# EAGLE design card (EAGLE 7.4.0)
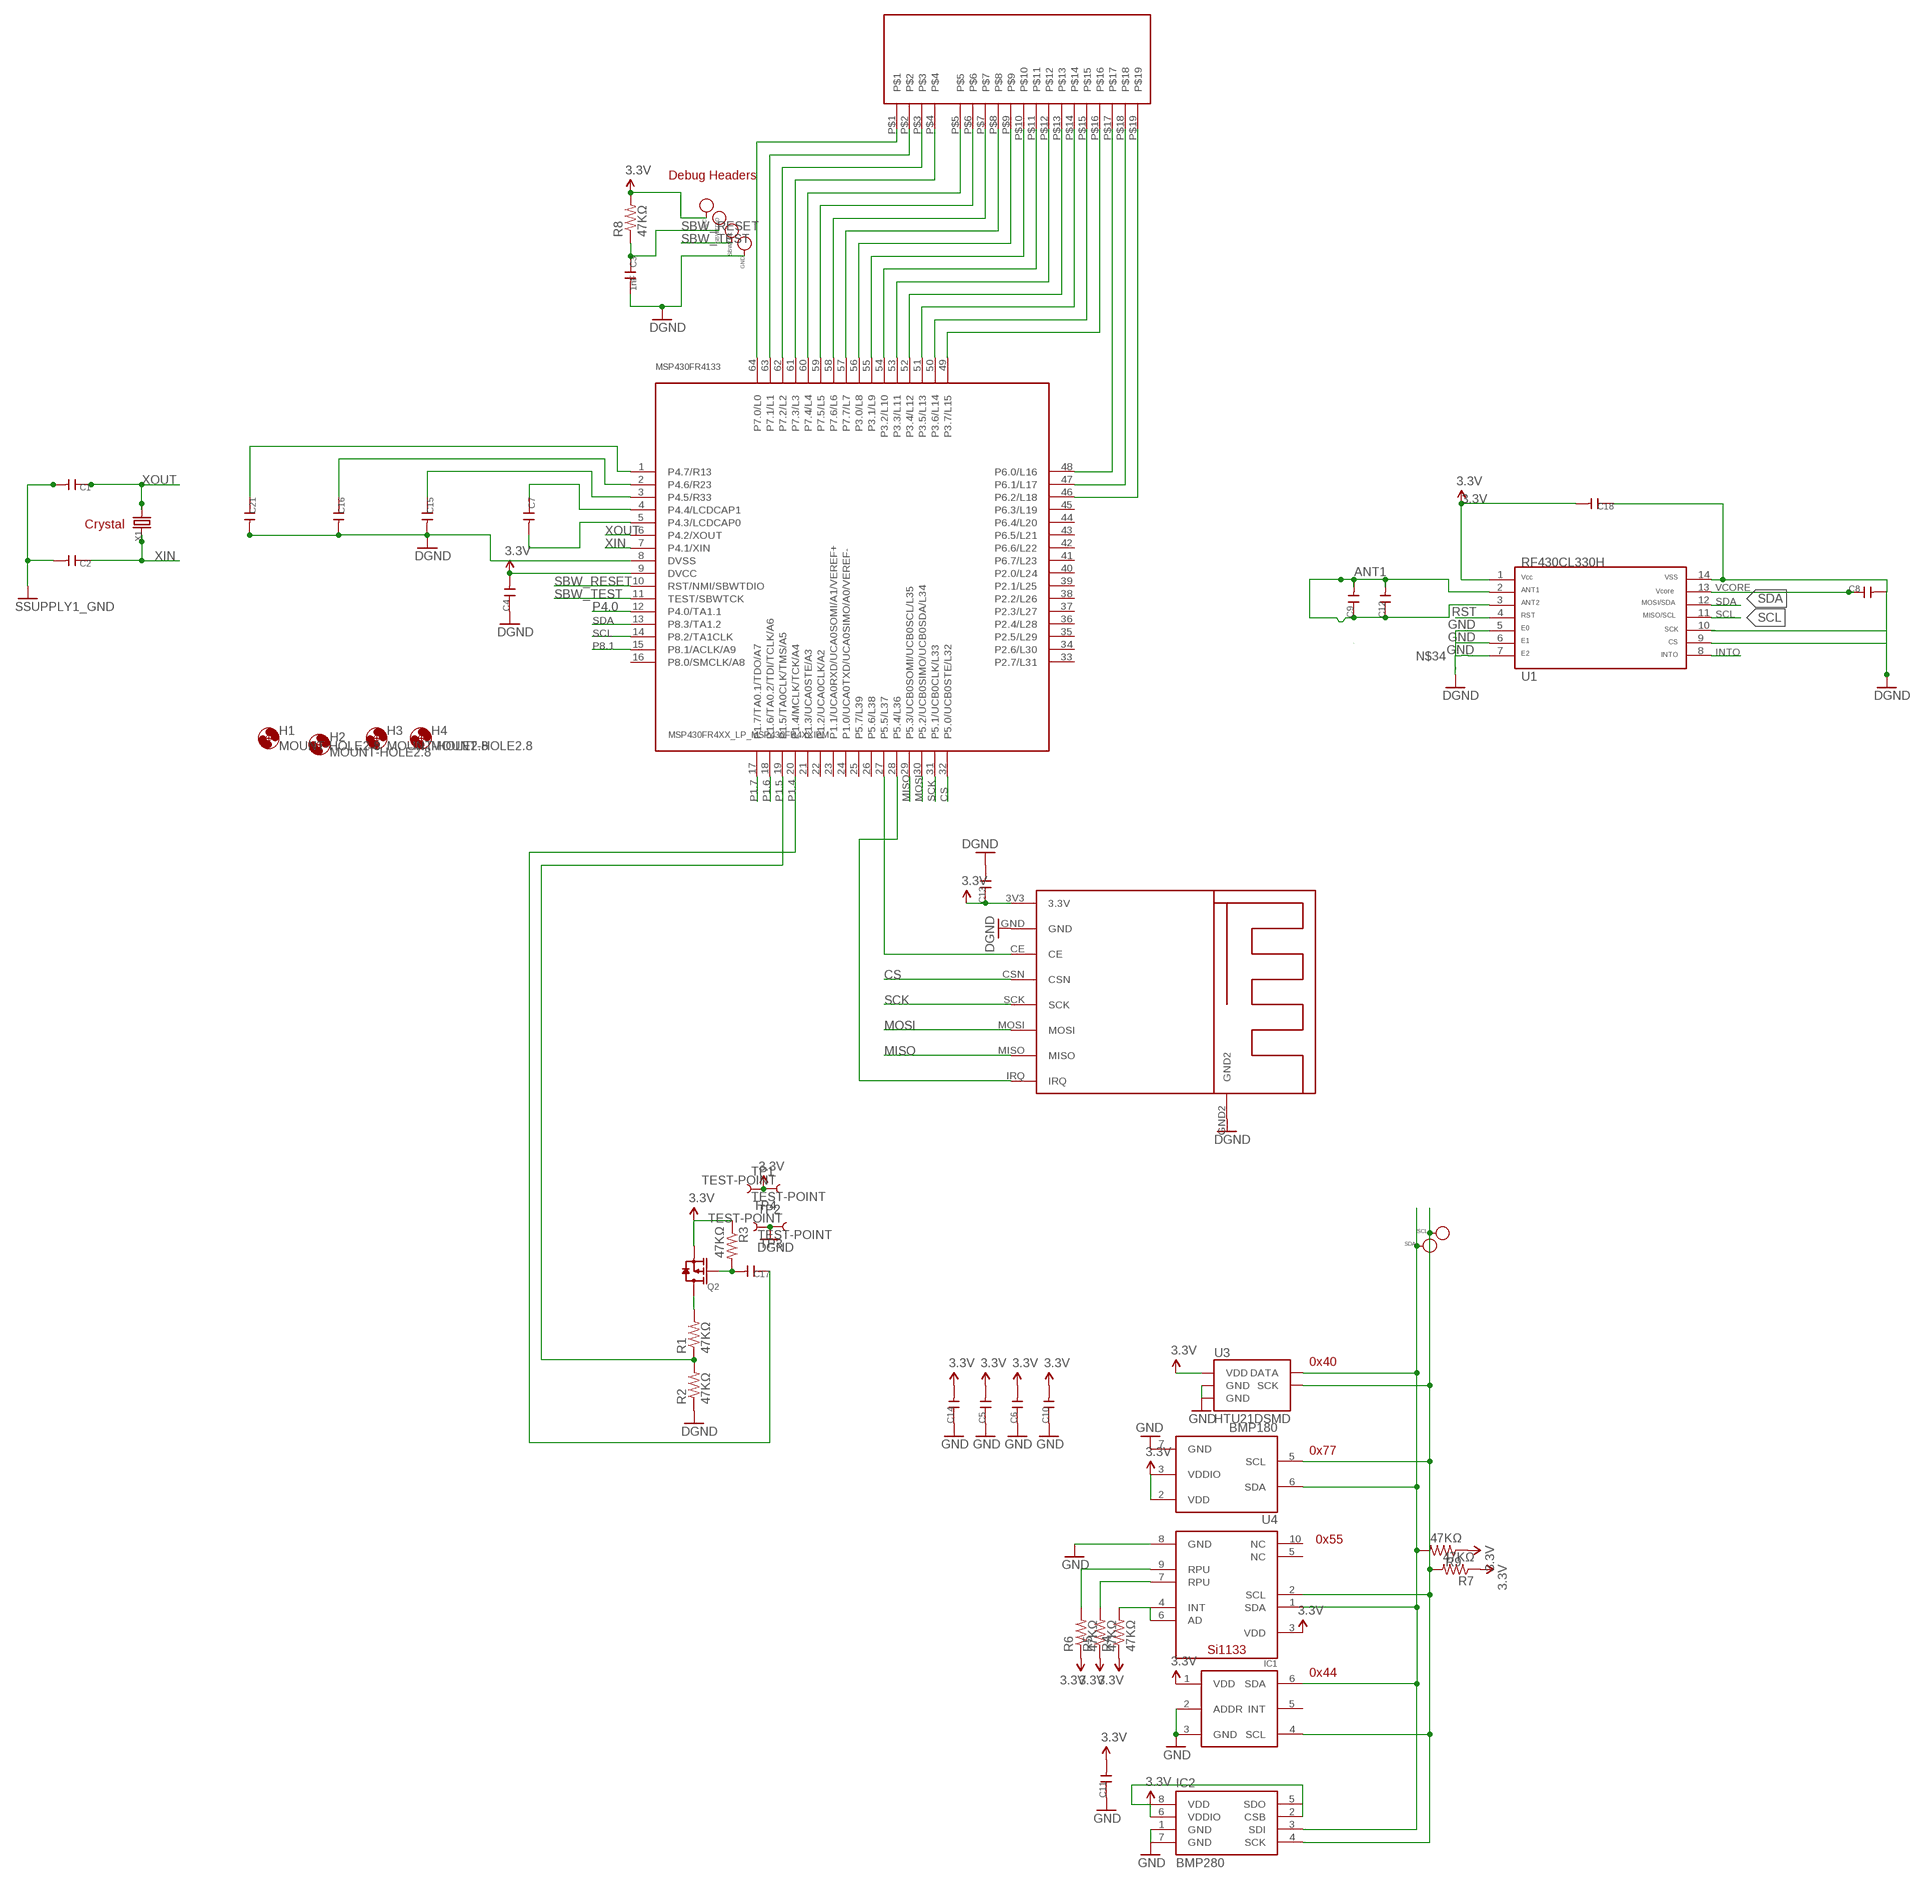
[diagram p0: schematic, sheet 1]

## Parts
C1  C-0402  [C0402]
C2  C-0402  [C0402]
C3  1nF  C-0402  [C0402]
C4  C-0402  [C0402]
C5  C-0402  [C0402]
C6  C-0402  [C0402]
C7  C-0402  [C0402]
C8  C-0402  [C0402]
C9  C-0402  [C0402]
C10  C-0402  [C0402]
C11  C-0402  [C0402]
C12  C-0402  [C0402]
C13  C-0603  [C0603]
C14  C-0402  [C0402]
C15  C-0402  [C0402]
C16  C-0402  [C0402]
C17  C-0402  [C0402]
C18  C-0402  [C0402]
C21  C-0402  [C0402]
GND  PAD-TEST-POINT'4545'  [TP_4545]
H1  MOUNT-HOLE2.8  [2,8]
H2  MOUNT-HOLE2.8  [2,8]
H3  MOUNT-HOLE2.8  [2,8]
H4  MOUNT-HOLE2.8  [2,8]
IC1  SILICONLABS-SI1133  [SILICONLABS-SI1133]
IC2  BMP280  [LGA]
MSP430FR4133  MSP430FR4XX_LP_MSP430FR4XXIPM  [MSP430G6_LP_LQFP64]
Q2  MOSFET-P'SI2323CDS/SI2305DS<BR>'  [SOT23]
R1  47KΩ  RESISTOR_1005  [RCL_R1005]
R2  47KΩ  RESISTOR_1005  [RCL_R1005]
R3  47KΩ  RESISTOR_1005  [RCL_R1005]
R4  47KΩ  RESISTOR_1005  [RCL_R1005]
R5  47KΩ  RESISTOR_1005  [RCL_R1005]
R6  47KΩ  RESISTOR_1005  [RCL_R1005]
R7  47KΩ  RESISTOR_1005  [RCL_R1005]
R8  47KΩ  RESISTOR_1005  [RCL_R1005]
R9  47KΩ  RESISTOR_1005  [RCL_R1005]
SBWTCK  PAD-TEST-POINT'4545'  [TP_4545]
SBWTDIO  PAD-TEST-POINT'4545'  [TP_4545]
SCL  PAD-TEST-POINT'4545'  [TP_4545]
SDA  PAD-TEST-POINT'4545'  [TP_4545]
TP1  TEST-POINT  [BATTERY]
TP2  TEST-POINT  [BATTERY]
TP3  TEST-POINT  [BATTERY]
TP4  TEST-POINT  [BATTERY]
U1  RF430CL330H  [PW14]
U3  HTU21DSMD  [HTU21D]
U4  BMP180  [BMP180]
U$1  HUMIDITYTEMP_DISPLAY  [HUMIDITYTEMP_DISPLAY]
U$2  NRF24MINI  [NRF24MINI]
U$5  TI-OPT3001  [TI-OPT3001]
VCC  PAD-TEST-POINT'4545'  [TP_4545]
X1  CRYSTAL-3215  [2P-SMD-3.2X1.5]

## Nets
3.3V: C4.2 C5.2 C6.2 C10.2 C11.2 C13.1 C14.2 C18.2 IC1.3(VDD) IC2.2(CSB) IC2.5(SDO) IC2.6(VDDIO) IC2.8(VDD) MSP430FR4133.9(DVCC) Q2.2(S) R3.1 R4.1 R5.1 R6.1 R7.1 R8.2 R9.1 TP1.P$1 TP4.P$1 U1.1 U3.VDD U4.2(VDD) U4.3(VDDIO) U$2.3V3(3.3V) U$5.1(VDD) VCC.T
ANT1: C9.1 C9.2 C12.1 C12.2 U1.2 U1.3
CS: MSP430FR4133.32(P5.0/UCB0STE/L32) U$2.CSN
GND: C1.2 C2.2 C3.2 C4.1 C5.1 C6.1 C8.2 C10.1 C11.1 C13.2 C14.1 C15.2 C16.2 C18.1 C21.2 GND.T IC1.8(GND) IC2.1(GND) IC2.7(GND) MSP430FR4133.8(DVSS) R2.1 TP2.P$1 TP3.P$1 U1.5 U1.6 U1.7 U1.9 U1.10 U1.14 U3.7(GND) U3.GND U4.7(GND) U$2.GND U$2.GND2 U$5.2(ADDR) U$5.3(GND) ; supply symbol labelled SSUPPLY1_GND, DGND
INTO: U1.8
MISO: MSP430FR4133.29(P5.3/UCB0SOMI/UCB0SCL/L35) U$2.MISO
MOSI: MSP430FR4133.30(P5.2/UCB0SIMO/UCB0SDA/L34) U$2.MOSI
N$1: MSP430FR4133.27(P5.5/L37) U$2.CE
N$2: MSP430FR4133.28(P5.4/L36) U$2.IRQ
N$3: MSP430FR4133.64(P7.0/L0) U$1.P$1
N$4: MSP430FR4133.63(P7.1/L1) U$1.P$2
N$5: MSP430FR4133.62(P7.2/L2) U$1.P$3
N$6: MSP430FR4133.61(P7.3/L3) U$1.P$4
N$7: Q2.3(D) R1.2
N$8: MSP430FR4133.60(P7.4/L4) U$1.P$5
N$9: MSP430FR4133.59(P7.5/L5) U$1.P$6
N$10: MSP430FR4133.58(P7.6/L6) U$1.P$7
N$11: MSP430FR4133.57(P7.7/L7) U$1.P$8
N$12: MSP430FR4133.56(P3.0/L8) U$1.P$9
N$13: MSP430FR4133.55(P3.1/L9) U$1.P$10
N$14: MSP430FR4133.54(P3.2/L10) U$1.P$11
N$15: MSP430FR4133.53(P3.3/L11) U$1.P$12
N$16: MSP430FR4133.52(P3.4/L12) U$1.P$13
N$17: MSP430FR4133.51(P3.5/L13) U$1.P$14
N$18: MSP430FR4133.50(P3.6/L14) U$1.P$15
N$19: MSP430FR4133.49(P3.7/L15) U$1.P$16
N$20: MSP430FR4133.48(P6.0/L16) U$1.P$17
N$21: MSP430FR4133.47(P6.1/L17) U$1.P$18
N$22: IC1.4(INT) IC1.6(AD) R4.2
N$23: MSP430FR4133.46(P6.2/L18) U$1.P$19
N$24: C21.1 MSP430FR4133.1(P4.7/R13)
N$25: C16.1 MSP430FR4133.2(P4.6/R23)
N$26: C15.1 MSP430FR4133.3(P4.5/R33)
N$27: C7.1 MSP430FR4133.4(P4.4/LCDCAP1)
N$28: C7.2 MSP430FR4133.5(P4.3/LCDCAP0)
N$29: IC1.9(RPU) R6.2
N$30: IC1.7(RPU) R5.2
N$31: C17.2 Q2.1(G) R3.2
P1.4: MSP430FR4133.19(P1.5/TA0CLK/TMS/A5) R1.1 R2.2
P1.5: C17.1 MSP430FR4133.20(P1.4/MCLK/TCK/A4)
P1.6: MSP430FR4133.18(P1.6/TA0.2/TDI/TCLK/A6)
P1.7: MSP430FR4133.17(P1.7/TA0.1/TDO/A7)
P4.0: MSP430FR4133.12(P4.0/TA1.1)
P8.1: MSP430FR4133.15(P8.1/ACLK/A9)
RST: U1.4
SBW_RESET: C3.1 MSP430FR4133.10(RST/NMI/SBWTDIO) R8.1 SBWTDIO.T
SBW_TEST: MSP430FR4133.11(TEST/SBWTCK) SBWTCK.T
SCK: MSP430FR4133.31(P5.1/UCB0CLK/L33) U$2.SCK
SCL: IC1.2(SCL) IC2.4(SCK) MSP430FR4133.14(P8.2/TA1CLK) R7.2 SCL.T U1.11 U3.SCK U4.5(SCL) U$5.4(SCL)
SDA: IC1.1(SDA) IC2.3(SDI) MSP430FR4133.13(P8.3/TA1.2) R9.2 SDA.T U1.12 U3.DATA U4.6(SDA) U$5.6(SDA)
VCORE: C8.1 U1.13
XIN: C2.1 MSP430FR4133.7(P4.1/XIN) X1.1
XOUT: C1.1 MSP430FR4133.6(P4.2/XOUT) X1.2
Unconnected: IC1.5(NC) IC1.10(NC) MSP430FR4133.16(P8.0/SMCLK/A8) MSP430FR4133.21(P1.3/UCA0STE/A3) MSP430FR4133.22(P1.2/UCA0CLK/A2) MSP430FR4133.23(P1.1/UCA0RXD/UCA0SOMI/A1/VEREF+) MSP430FR4133.24(P1.0/UCA0TXD/UCA0SIMO/A0/VEREF-) MSP430FR4133.25(P5.7/L39) MSP430FR4133.26(P5.6/L38) MSP430FR4133.33(P2.7/L31) MSP430FR4133.34(P2.6/L30) MSP430FR4133.35(P2.5/L29) MSP430FR4133.36(P2.4/L28) MSP430FR4133.37(P2.3/L27) MSP430FR4133.38(P2.2/L26) MSP430FR4133.39(P2.1/L25) MSP430FR4133.40(P2.0/L24) MSP430FR4133.41(P6.7/L23) MSP430FR4133.42(P6.6/L22) MSP430FR4133.43(P6.5/L21) MSP430FR4133.44(P6.4/L20) MSP430FR4133.45(P6.3/L19) U$5.5(INT)

## Notes on the sheet
- Debug Headers
- Crystal
- 0x40
- 0x77
- 0x55
- 0x44

## Library data of the parts
C1-C18 C21 = Discrete:C*: Ceramic Capacitors
GND SBWTCK SBWTDIO SCL SDA VCC = Discrete:PAD-TEST-POINT; PARTNO: DNP
H1-H4 = holes:MOUNT-HOLE: MOUNTING HOLE with drill center marker
IC1 = FaBo-Mems:SILICONLABS-SI1133
IC2 = we-sensor:BMP280: BOSCH BMP280 Digital Pressure Sensor
MSP430FR4133 = air_quality_index:MSP430FR4XX_LP_MSP430FR4XXIPM
Q2 = Discrete:MOSFET-P
R1-R9 = air_quality_index:RESISTOR_1005
TP1-TP4 = SparkFun-Passives:TEST-POINT: Bare copper test points for troubleshooting or ICT
U1 = TI_MSP430_v16:RF430CL330H: RF430CL330H ISO14443B Dynamic NFC Tag
U3 = SparkFun-Sensors:HTU21D
U4 = SparkFun-Sensors:BMP180: BOSCH BMP180 DIGITAL BAROMETRIC PRESSURE SENSOR Web page: http://www.bosch-sensortec.com/en/homepage/products_3/environmental_sensors_1/bmp180_1/bmp180 Datasheet: http://ae-bst.resource.bosch.com/media/products/dokumente/bmp180/BST-BMP180-DS000-09.pdf The BMP180 is the function compatible successor of the BMP085, a new generation of high precision digital pressure sensors for consumer applications. The ultra-low power, low voltage electronics of the BMP180 is optimized for use in mobile phones, PDAs, GPS navigation devices and outdoor equipment. With a low altitude noise of merely 0.25m at fast conversion time, the BMP180 offers superior performance. The I2C interface allows for easy system integration with a microcontroller. The BMP180 is based on piezo-resistive technology for EMC robustness, high accuracy and linearity as well as long term stability. Key features: - Temperature measurement included - I2C interface - Fully calibrated - Pb-free, halogen-free and RoHS compliant, - MSL 1 Basic specs: Pressure range: 300 to 1100hPa (+9000m to -500m relating to sea level) Supply voltage: 1.8 to 3.6V (VDD), 1.62V to 3.6V (VDDIO) Package: LGA package with metal lid Small footprint: 3.6mm x 3.8mm Super-flat: 0.93mm height Low power: 5μA at 1 sample / sec. in standard mode Low noise: 0.06hPa (0.5m) in ultra low power mode, 0.02hPa (0.17m) advanced resolution mode Typical applications: - Enhancement of GPS navigation (dead-reckoning, slope detection, etc.) - In- and out-door navigation - Leisure and sports - Weather forecast - Vertical velocity indication (rise/sink speed)
U$1 = SparkFun-Displays:HUMIDITYTEMP_DISPLAY
U$2 = nrf24mini:NRF24MINI
U$5 = FaBo-Mems:TI-OPT3001
X1 = Discrete:CRYSTAL*: CRYSTAL

## Board
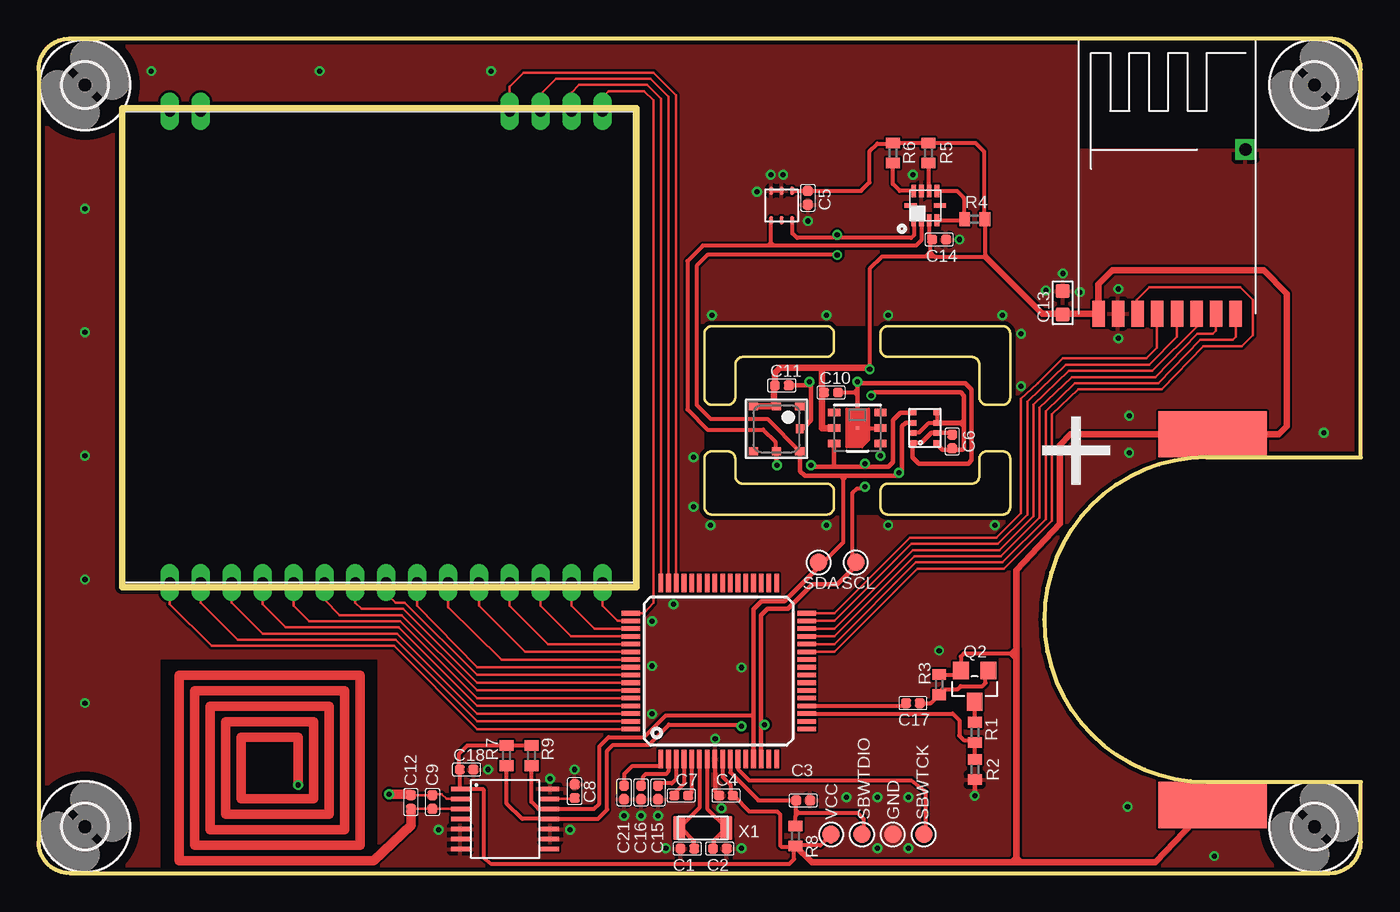
[diagram p1: board, top side]
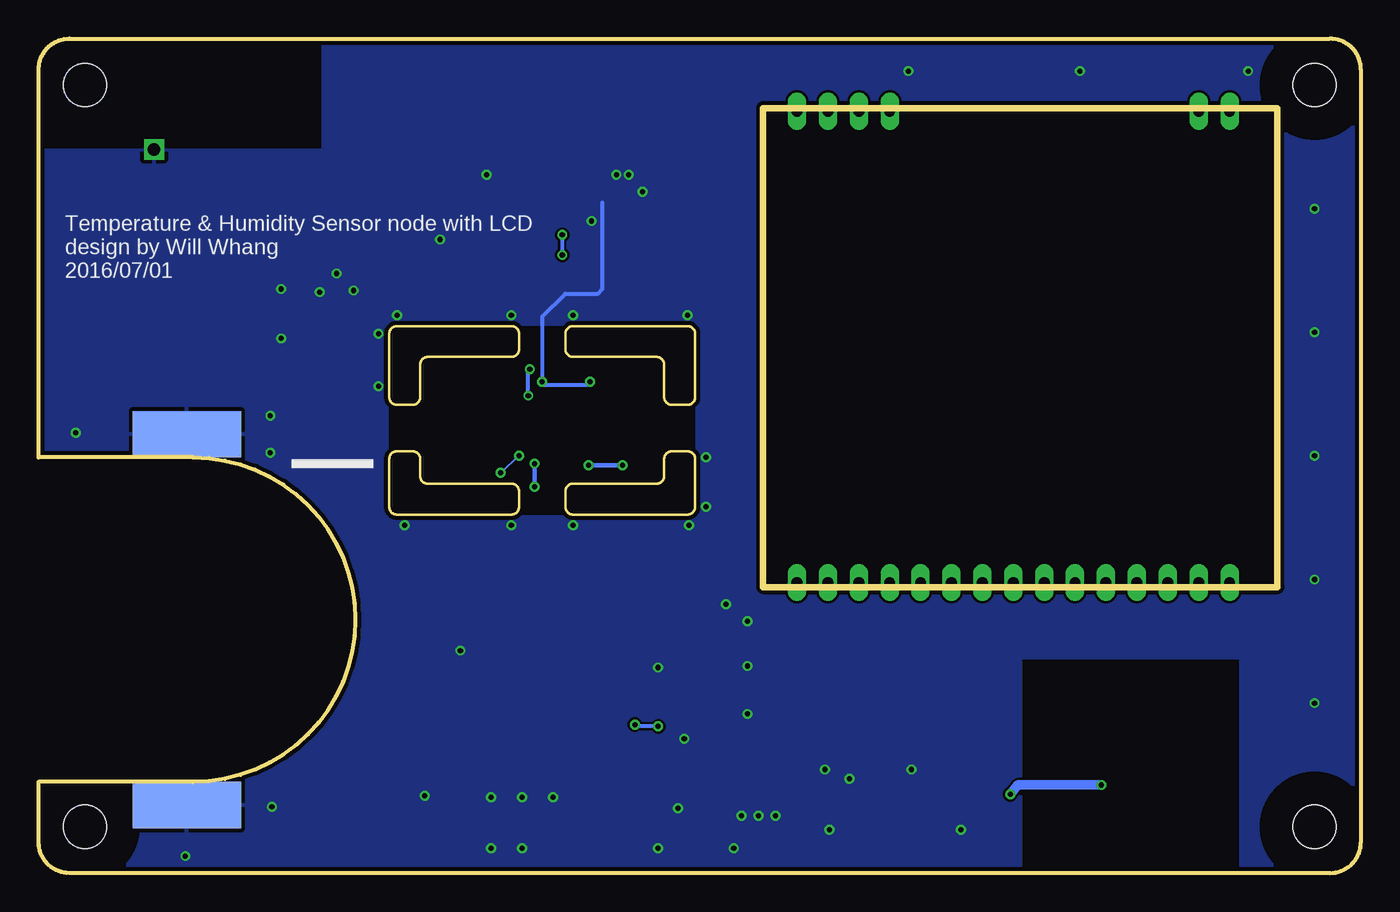
[diagram p2: board, bottom side, seen from below]

Size 85.6 x 54 mm. Coordinates in mm from the lower left corner, seen from the top.
Outline: 2,0 83.6,0 arc90 85.6,2 85.6,5.9 75.6,5.9 arc-180 75.6,26.9 85.6,26.9 85.6,52 arc90 83.6,54 2,54 arc90 0,52 0,2 arc90 2,0
Outline: 5.4,49.5 38.7,49.5 38.7,18.5 5.4,18.5 5.4,49.5
Outline: 43.6,23.2 51,23.2 arc90 51.5,23.7 51.5,24.7 arc90 51,25.2 45.6,25.2 arc-90 45.1,25.7 45.1,26.8 arc90 44.6,27.3 43.6,27.3 arc90 43.1,26.8 43.1,23.7 arc90 43.6,23.2
Outline: 43.6,30.3 44.6,30.3 arc90 45.1,30.8 45.1,32.9 arc-90 45.6,33.4 51,33.4 arc90 51.5,33.9 51.5,34.9 arc90 51,35.4 43.6,35.4 arc90 43.1,34.9 43.1,30.8 arc90 43.6,30.3
Outline: 55,35.4 62.4,35.4 arc-90 62.9,34.9 62.9,30.8 arc-90 62.4,30.3 61.4,30.3 arc-90 60.9,30.8 60.9,32.9 arc90 60.4,33.4 55,33.4 arc-90 54.5,33.9 54.5,34.9 arc-90 55,35.4
Outline: 55,25.2 arc90 54.5,24.7 54.5,23.7 arc90 55,23.2 62.4,23.2 arc90 62.9,23.7 62.9,26.8 arc90 62.4,27.3 61.4,27.3 arc90 60.9,26.8 60.9,25.7 arc-90 60.4,25.2 55,25.2
Copper layers (1*16): Top 0.035mm / dielectric 1.5mm / Bottom 0.035mm
Design rules "SeeedStudio_2layer_DRU_no_angle_20140221": minimum track width 6mil, minimum drill 12mil, track to track 6mil, track to pad 6mil, pad to pad 6mil, via to via 6mil, smd to smd 0mil, copper to edge 10mil, drill to drill 10mil, minimum pad ring 10mil, minimum via ring 6mil, stop-mask expansion 2mil, vias tented up to drill 100mil, thermal gap 10mil
tRestrict: area 7.9,-0.2 to 21.9,13.8; area 67.4,46.9 to 87.2,54; area 43.1,23.2 to 62.9,35.4
bRestrict: area 7.9,-0.2 to 21.9,13.8; area 67.3,46.9 to 87.1,54; area 43.1,23.2 to 62.9,35.4

### Footprints (pad centres in the part's own frame; a part is rotated, then mirrored left to right if it is on the bottom)
C0402 = smd 0.635 x 0.635: 1 -0.445,0; 2 0.445,0
C0603 = smd 0.889 x 0.889: 1 -0.762,0; 2 0.762,0
TP_4545 = smd 1.143 x 1.143: T 0,0
2,8 = hole 2.8: 0,0
SILICONLABS-SI1133 = smd 0.8 x 0.3: 1 -0.95,0.75; 2 -0.95,0.25; 3 -0.95,-0.25; 4 -0.95,-0.75; 6 0.95,-0.75; 7 0.95,-0.25; 8 0.95,0.25; 9 0.95,0.75 | smd 0.3 x 0.8: 5 0,-0.95; 10 0,0.95
LGA = smd 0.5 x 0.35: 1 0.8,0.975; 2 0.8,0.325; 3 0.8,-0.325; 4 0.8,-0.975; 5 -0.8,-0.975; 6 -0.8,-0.325; 7 -0.8,0.325; 8 -0.8,0.975
MSP430G6_LP_LQFP64 = smd 1.2 x 0.3: 1 -5.649,3.623; 2 -5.649,3.123; 3 -5.649,2.623; 4 -5.649,2.123; 5 -5.649,1.623; 6 -5.649,1.123; 7 -5.649,0.623; 8 -5.649,0.123; 9 -5.649,-0.377; 10 -5.649,-0.877; 11 -5.649,-1.377; 12 -5.649,-1.877; 13 -5.649,-2.377; 14 -5.649,-2.877; 15 -5.649,-3.377; 16 -5.649,-3.877; 33 5.751,-3.877; 34 5.751,-3.377; 35 5.751,-2.877; 36 5.751,-2.377; 37 5.751,-1.877; 38 5.751,-1.377; 39 5.751,-0.877; 40 5.751,-0.377; 41 5.751,0.123; 42 5.751,0.623; 43 5.751,1.123; 44 5.751,1.623; 45 5.751,2.123; 46 5.751,2.623; 47 5.751,3.123; 48 5.751,3.623 | smd 0.3 x 1.2: 17 -3.699,-5.827; 18 -3.199,-5.827; 19 -2.699,-5.827; 20 -2.199,-5.827; 21 -1.699,-5.827; 22 -1.199,-5.827; 23 -0.699,-5.827; 24 -0.199,-5.827; 25 0.301,-5.827; 26 0.801,-5.827; 27 1.301,-5.827; 28 1.801,-5.827; 29 2.301,-5.827; 30 2.801,-5.827; 31 3.301,-5.827; 32 3.801,-5.827; 49 3.801,5.573; 50 3.301,5.573; 51 2.801,5.573; 52 2.301,5.573; 53 1.801,5.573; 54 1.301,5.573; 55 0.801,5.573; 56 0.301,5.573; 57 -0.199,5.573; 58 -0.699,5.573; 59 -1.199,5.573; 60 -1.699,5.573; 61 -2.199,5.573; 62 -2.699,5.573; 63 -3.199,5.573; 64 -3.699,5.573
SOT23 = smd 1.016 x 1.143: 1 -0.889,-1.016; 2 0.889,-1.016; 3 0,1.016
RCL_R1005 = smd 0.7 x 0.9: 1 -0.65,0; 2 0.65,0
BATTERY = smd 3 x 7: P$1 0,0
PW14 = smd 0.3 x 1.2: 1 -1.95,-2.9; 2 -1.3,-2.9; 3 -0.65,-2.9; 4 0,-2.9; 5 0.65,-2.9; 6 1.3,-2.9; 7 1.95,-2.9; 8 1.95,2.9; 9 1.3,2.9; 10 0.65,2.9; 11 0,2.9; 12 -0.65,2.9; 13 -1.3,2.9; 14 -1.95,2.9
HTU21D = smd 0.2 x 0.2: 7 0,0 | smd 0.8 x 0.5: DATA 1.5,-1; GND 1.5,0; NC@1 -1.5,1; NC@6 1.5,1; SCK -1.5,-1; VDD -1.5,0
BMP180 = smd 0.6 x 0.5: 1 1.5,1.45; 2 0,1.45; 3 -1.5,1.45; 4 -1.5,-1.45; 5 0,-1.45; 6 1.5,-1.45 | smd 0.5 x 0.6: 7 1.5,0
HUMIDITYTEMP_DISPLAY = drill 0.7 pad 1.2 long: P$1 3,0; P$2 5,0; P$3 7,0; P$4 9,0; P$5 11,0; P$6 13,0; P$7 15,0; P$8 17,0; P$9 19,0; P$10 21,0; P$11 23,0; P$12 25,0; P$13 27,0; P$14 29,0; P$15 31,0; P$16 31,30.5; P$17 29,30.5; P$18 27,30.5; P$19 25,30.5; P$20 5,30.5; P$21 3,30.5
NRF24MINI = smd 1.676 x 0.813: 3V3 0,8.89; CE 0,6.35; CSN 0,5.08; GND 0,7.62; IRQ 0,0; MISO 0,1.27; MOSI 0,2.54; SCK 0,3.81 | drill 0.8 square: GND2 10.625,-0.625
TI-OPT3001 = smd 0.5 x 0.25: 1 -0.95,0.675; 2 -0.95,0; 3 -0.95,-0.675; 4 0.95,-0.675; 5 0.95,0; 6 0.95,0.675
2P-SMD-3.2X1.5 = smd 0.762 x 1.524: 1 -1.524,0; 2 1.524,0

### Placement (x,y rotation side)
C1  42,1.58 180 top
C2  44.1,1.58 0 top
C3  49.5,4.7 0 top
C4  44.5,5.02 0 top
C5  49.8,43.7 90 top
C6  59.15,27.93 270 top
C7  41.6,5.02 0 top
C8  34.7,5.3 90 top
C9  25.5,4.6 90 top
C10  51.3,31.1 180 top
C11  48.11,31.56 180 top
C12  24.1,4.6 90 top
C13  66.3,36.9 90 top
C14  58.3,41 180 top
C15  40.1,5.22 270 top
C16  39,5.22 270 top
C17  56.6,11 0 top
C18  27.7,6.7 180 top
C21  37.9,5.22 270 top
GND  55.3,2.5 90 top
H1  3,51 0 top
H2  3,3 0 top
H3  82.6,3 0 top
H4  82.6,51 0 top
IC1  57.4,43.2 90 top
IC2  57.38,28.81 180 top
MSP430FR4133  43.9,13.02 90 top
Q2  60.6,12.1 180 top
R1  60.6,9.1 90 top
R2  60.6,6.7 90 top
R3  58.3,12.2 270 top
R4  60.6,42.3 180 top
R5  57.6,46.6 270 top
R6  55.3,46.6 270 top
R7  30.3,7.6 270 top
R8  49,2.4 270 top
R9  31.9,7.6 270 top
SBWTCK  57.3,2.5 90 top
SBWTDIO  53.3,2.5 90 top
SCL  52.9,20.1 0 top
SDA  50.5,20.1 0 top
TP1  76,28.4 90 top
TP2  76,4.4 90 bottom
TP3  76,28.4 90 bottom
TP4  76,4.4 90 top
U1  30.2,3.5 270 top
U3  53,28.8 0 top
U4  47.77,28.75 0 top
U$1  5.5,18.8 0 top
U$2  77.5,36.2 90 top
U$5  48.1,43.2 270 top
VCC  51.3,2.5 90 top
X1  43,2.92 180 top

### Tracks (layer width: path | path; a pad name or v marks a point on that pad's centre or on a via)
3.3V  (via drill 0.33)
  Top 0.254: MSP430FR4133.9 44.28,6.22 44.8,5.7 44.8,5.16 C4.2 45.04,4.96 46,4 47.8,4 48,3.8 48,1.8 48.1,1.7 48.95,1.7 R8.2 | VCC.T 50.6,1.8 49.05,1.8 R8.2 | 50.7,30.9 50.7,30.95 C10.2 | 50.7,32.6 v53.8,32.6 53.8,39.1 54.6,39.9 57.4,39.9 | R8.2 48.9,1.65 48.9,0.9 48.6,0.6 29.3,0.6 28.8,1 28.8,5.4 28.75,5.45 U1.1 27.26,5.49 C18.2 27.2,6.75 27.2,7.7 27.75,8.25 R7.1 R9.1 | C14.2 57.65,41.01 IC1.3 57.65,41.05 57.7,41 57.7,40.2 | 57.7,40.2 58,39.9 | 58,39.9 61.2,39.9 | 61.2,39.9 61.3,39.9 61.3,40 | 61.2,39.9 61.3,40 | 61.3,40 61.3,42.25 R4.1 61.2,42.35 | U$5.1 C5.2 53.24,44.15 53.8,44.7 53.8,46.7 54.3,47.2 55.25,47.2 R6.1 R5.1 60.65,47.25 61.2,46.7 61.2,42.35 | 61.2,42.3 61.2,42.35 | 58,39.9 57.4,39.9 | 57.7,40.2 57.4,39.9 | 63,14.2 59.9,14.2 59.7,14 Q2.2 59.58,12.85 R3.1 | IC2.6 IC2.5 | 58.1,29.1 57.6,29.1 57,28.5 IC2.2
  Top 0.305: IC2.8 58.18,27.72 58.5,27.4 59.06,27.4 C6.2 59.23,27.4 59.8,27.4 59.9,27.5 59.9,28.9 | 59.7,29.1 59.66,29.14 IC2.6 59.26,29.14 59.3,29.1 | 59.3,29.1 58.1,29.1 | 59.3,29.1 59.7,29.1 | 59.7,29.1 59.9,28.9 | 59.9,28.9 59.9,29.3 | 59.7,29.1 59.9,29.3 | 59.9,29.3 59.9,30.9 59.7,31.1 54.1,31.1 v53.9,30.9 | 52.3,32.7 50.7,32.7
  Top 0.406: U3.VDD 50.7,28.8 50.7,30.9 50.7,31.14 | U4.3 U4.2 47.6,30.2 47.6,31.5 47.57,31.56 C11.2 47.67,32.37 48,32.7 50.7,32.7 | 53.8,32.7 50.7,32.7 | 50.7,32.7 50.7,32.6 50.7,31.14 | 50.7,31.14 C10.2 | VCC.T 51.3,2.1 | 63,0.7 50.05,0.7 R8.2 | 63.3,1 63.6,0.7 | 63.6,0.7 72.3,0.7 76,4.6 | 76.5,4.6 76,4.6 | 76,4.6 75.3,4.6 75.2,4.5 75.9,4.5 TP4.P$1 | 63,14.2 63.3,13.9 | 63.3,13.9 63.3,1 | 63.3,1 63,0.7 | 63,0.7 63.6,0.7 | TP1.P$1 77.8,29.5 | 77.8,29.5 77.5,29.5 78,29.6 77.8,29.5 | 63,14.2 63.3,14.2 | 63.3,14.2 63.3,13.9 | 63.3,14.2 63.3,14.5 | 63,14.2 63.3,14.5 | 63.3,14.5 63.3,19.6 66.1,22.6 66.1,27.7 66.8,28.4 TP1.P$1 | TP1.P$1 80.3,28.4 80.8,28.9 80.8,37.5 79.3,39 69.5,39 68.6,38.1 U$2.3V3 | 66.37,36.21 C13.1 | 66.37,36.21 64.99,36.21 61.3,39.9 | 66.37,36.21 U$2.3V3 | U$2.3V3
  Bottom 0.254: v53.9,30.9 53.9,32.5 v53.8,32.6
ANT1  (via drill 0.33)
  Top 0.178: U1.2 26.4,4.8 26.1,5.1 25.55,5.1 C9.2 C12.2 | C12.1 C9.1 U1.3
  Top 0.6: C12.1 24.1,3.1 21.7,0.8 9.1,0.8 9.1,12.8 20.8,12.8 20.8,1.8 10.1,1.8 10.1,11.8 19.8,11.8 19.8,2.8 11.1,2.8 11.1,10.8 18.8,10.8 18.8,3.8 12.1,3.8 12.1,9.8 17.8,9.8 17.8,4.8 13.1,4.8 13.1,8.8 16.8,8.8 v16.8,5.7 | v22.7,5.1 24.04,5.1 C12.2
  Bottom 0.6: v16.8,5.7 22.2,5.7 v22.7,5.1
CS
  Top 0.178: MSP430FR4133.32 51.52,16.82 56.4,21.7 62,21.7 63.6,23.3 63.6,30.7 64.7,31.7 66.3,33.3 71.7,33.3 72.4,34 72.4,36.2 72.3,36.4 72.7,36.8 72.7,36.48 U$2.CSN
GND  (via drill 0.33)
  Top 0.254: U3.7 U3.GND | 53,31.7 53.2,31.8 v53,31.8 | MSP430FR4133.8 43.78,5.3 C4.1 | U$5.2 U$5.3 | C10.1 52.8,31.1 | 52.8,31.1 53,30.9 | 53,31.3 52.8,31.1
  Top 0.305: C6.1 59.03,28.49 IC2.7 57.79,28.49 57.14,27.84 IC2.1 56.58,26.92 57,26.5 60.2,26.5 60.4,26.7 60.4,31.3 60,31.7 53.1,31.7 | 53.1,31.7 53,31.7 53,31.3 53,30.9 U3.7 | U4.7 49.22,28.8 49.5,28.8 50,29.3 50,31.7 v49.9,31.8 49.94,31.56 C11.1 | v53,31.8 53.1,31.7 | R2.1 v60.6,5
  Bottom 0.254: 53,31.6 50.1,31.6 | 49.1,43.4 49.1,37.8 49.4,37.5 51.5,37.5 53,36 v53,31.8
  Bottom 0.305: v49.9,31.8 50.1,31.6 | 53,31.6 v53,31.8
  other vias: 48.2,45.2 46.5,44.1 49.8,42.2 67.4,37.6 52.3,4.9 54.3,4.9 56.3,4.9 40.6,1.6 45.5,1.6 37.9,3.7 39,3.7 40.1,3.7 34.7,6.7 33.1,6.1 25.9,2.8 29.1,6.7 43.8,8.7 76.1,1.1 83.2,28.5 70.5,4.3 39.7,16.3 39.7,10.3 41.1,17.4 39.7,13.4 45.5,13.3 59.6,41 56.6,45.2 43.6,36.1 51,36.1 66.3,38.8 55,36.1 47.4,45.2 43.5,22.5 51,22.5 55,22.5 42.4,26.9 62.4,36.1 58.3,14.4 3,11 3,19 3,27 3,35 7.3,51.9 29.3,51.9 18.2,51.9 3,43 65.2,37.7 70.6,29.6 70.6,27.2 69.9,37.8 69.9,34.6 42.4,23.7 63.6,34.9 61.9,22.5 63.6,31.5 54.3,1.6 56.3,1.6 44.2,4.2 34.4,2.8
  pour Top: 0,54 89.1,54 89.1,0 0,0
  pour Bottom: 0,54 89.5,54 89.5,0 0,0
MISO
  Top 0.178: MSP430FR4133.29 51.52,15.32 56.7,20.5 62.3,20.5 64.8,23 64.8,30.1 66.9,32.1 72.3,32.1 75,34.9 76,34.9 76.2,35.1 76.2,36.17 U$2.MISO
MOSI
  Top 0.178: MSP430FR4133.30 51.52,15.82 56.6,20.9 62.2,20.9 64.4,23.1 64.4,30.3 66.7,32.5 72.1,32.5 75,35.4 75,36.16 U$2.MOSI
N$1
  Top 0.178: MSP430FR4133.27 51.52,14.32 56.9,19.7 62.5,19.7 65.6,22.8 65.6,29.7 67.3,31.3 72.7,31.3 75.4,34.1 77.9,34.1 78.6,34.8 78.6,37.1 77.8,37.9 71.9,37.9 71.1,37.1 71.1,36.25 U$2.CE
N$2
  Top 0.178: MSP430FR4133.28 51.52,14.82 56.8,20.1 62.4,20.1 65.2,22.9 65.2,29.9 67.1,31.7 72.5,31.7 75.2,34.5 77.3,34.5 77.5,34.7 U$2.IRQ
N$3
  Top 0.178: MSP430FR4133.64 28.38,9.32 23,14.7 11.2,14.7 8.5,17.4 U$1.P$1
N$4
  Top 0.178: MSP430FR4133.63 28.38,9.82 23.1,15.1 12.9,15.1 10.5,17.5 U$1.P$2
N$5
  Top 0.178: MSP430FR4133.62 28.38,10.32 23.2,15.5 14.5,15.5 12.5,17.5 U$1.P$3
N$6
  Top 0.178: MSP430FR4133.61 28.38,10.82 23.3,15.9 16,15.9 14.5,17.4 U$1.P$4
N$7
  Top 0.254: R1.2 Q2.3
N$8
  Top 0.178: MSP430FR4133.60 28.38,11.32 23.4,16.3 17.5,16.3 16.5,17.3 U$1.P$5
N$9
  Top 0.178: MSP430FR4133.59 28.38,11.82 23.5,16.7 19.5,16.7 18.5,17.7 U$1.P$6
N$10
  Top 0.178: MSP430FR4133.58 28.38,12.32 23.6,17.1 20.9,17.1 20.5,17.5 U$1.P$7
N$11
  Top 0.178: MSP430FR4133.57 28.38,12.82 23.7,17.5 23.1,17.5 22.5,18.1 U$1.P$8
N$12
  Top 0.178: MSP430FR4133.56 28.38,13.32 24.5,17.3 U$1.P$9
N$13
  Top 0.178: MSP430FR4133.55 29.98,13.82 26.5,17.2 U$1.P$10
N$14
  Top 0.178: MSP430FR4133.54 31.48,14.32 28.5,17.3 U$1.P$11
N$15
  Top 0.178: MSP430FR4133.53 32.98,14.82 30.5,17.3 U$1.P$12
N$16
  Top 0.178: MSP430FR4133.52 34.48,15.32 32.5,17.3 U$1.P$13
N$17
  Top 0.178: MSP430FR4133.51 35.98,15.82 34.5,17.3 U$1.P$14
N$18
  Top 0.178: 38.58,16.32 MSP430FR4133.50 37.48,16.32 36.5,17.3 U$1.P$15
N$19
  Top 0.178: U$1.P$16 36.5,50.2 36.9,50.6 39.2,50.6 39.8,50 39.8,17.5 39.2,16.8 38.34,16.8 MSP430FR4133.49 38.24,16.8
N$20
  Top 0.178: MSP430FR4133.48 40.28,50.12 39.4,51 35,51 34.5,50.5 U$1.P$17
N$21
  Top 0.178: MSP430FR4133.47 40.78,50.22 39.6,51.4 33.5,51.4 32.5,50.4 U$1.P$18
N$22
  Top 0.254: IC1.6 59.45,44.15 59.9,43.7 59.9,42.35 R4.2 59.9,42.25 IC1.4
N$23
  Top 0.178: MSP430FR4133.46 41.28,50.32 39.8,51.8 31.4,51.8 30.5,50.9 U$1.P$19
N$24
  Top 0.254: MSP430FR4133.1 40.28,6.98 40.2,6.9 38.4,6.9 37.9,6.4 C21.1
N$25
  Top 0.254: MSP430FR4133.2 40.78,6.58 40.6,6.4 39.3,6.4 39.1,6.2 39.1,5.76 C16.1
N$26
  Top 0.254: MSP430FR4133.3 41.28,6.08 41,5.8 40.14,5.8 C15.1
N$27
  Top 0.254: MSP430FR4133.4 41.78,5.78 41.2,5.2 41.2,5.06 C7.1
N$28
  Top 0.254: MSP430FR4133.5 42.28,5.25 C7.2
N$29
  Top 0.254: IC1.9 55.75,44.15 55.3,44.6 R6.2
N$30
  Top 0.254: R5.2 57.6,44.2 IC1.7
N$31
  Top 0.254: Q2.1 61.3,12.93 61.3,12.3 61.1,12.1 59.7,12.1 59.5,11.9 58.5,11.9 58.05,11.55 R3.2 57.75,11 C17.2
P1.4
  Top 0.178: 60.55,7.3 R2.2
  Top 0.254: 60.55,7.4 R2.2 R1.1 60.55,8.6 59.9,8.6 59.6,8.9 59.6,9.9 59.18,10.32 MSP430FR4133.19
P1.5
  Top 0.254: C17.1 56.06,10.96 56,10.8 49.74,10.8 MSP430FR4133.20
SBW_RESET
  Top 0.254: 49,4.7 49,3.7 | MSP430FR4133.10 44.78,6.52 46.6,4.7 49,4.7 | 49,4.7 C3.1 | R8.1 49,3.7 | 49,3.7 49.2,3.9 | 49,4.1 49.2,3.9 | 49.2,3.9 53,3.9 53.4,3.5 53.4,2.6 SBWTDIO.T
SBW_TEST
  Top 0.254: MSP430FR4133.11 45.28,6.72 46,6 56.5,6 57.4,5.3 57.4,2.6 SBWTCK.T
SCK
  Top 0.178: MSP430FR4133.31 51.52,16.32 56.5,21.3 62.1,21.3 64,23.2 64,30.5 66.5,32.9 71.9,32.9 73.7,34.7 73.7,36.3 73.6,36.11 U$2.SCK
SCL  (via drill 0.33)
  Top 0.254: 46.8,7.45 MSP430FR4133.14 | v45.5,9.5 45.4,9.6 40.8,9.6 39.5,8.3 37.2,8.3 36.8,7.9 36.8,4.1 36.2,3.5 U1.11 31.3,3.5 30.3,4.5 R7.2 | v47,9.6 46.98,9.6 46.78,9.4 | SCL.T 52.9,20.2 52.7,20.4 52.7,24.6 53,24.9 53.4,24.9 v53.5,25 | IC1.2 57.15,40.95 56.8,40.6 47.6,40.6 | 47.6,40.6 47.4,40.8 | 47.2,40.6 47.4,40.8 | 47.4,40.8 47.4,42.33 U$5.4 | 47.6,40.6 43,40.6 42,39.6 42,30 43.3,28.7 46.9,28.7 47.7,27.9 47.7,27.37 U4.5
  Top 0.305: IC2.4 55.79,29.79 55.3,29.3 55.3,26.6 55,26.3 53.5,26.3 | 53.5,26.3 51.5,26.3 | 51.5,26.3 U3.SCK | U4.5 47.77,26.53 v47.8,26.4 | v50,26.4 50.2,26.4 50.3,26.3 51.5,26.3 | MSP430FR4133.14 46.78,9.4 46.78,16.68 47.2,17.1 48.5,17.1 50.1,18.7 51.7,18.7 53,20 SCL.T | v53.5,26.5 53.5,26.3
  Bottom 0.254: v45.5,9.5 46.9,9.5 v47,9.6
  Bottom 0.305: v47.8,26.4 v50,26.4 | v53.5,25 v53.5,26.5
SDA  (via drill 0.33)
  Top 0.178: U3.DATA v54.5,27
  Top 0.254: 46.3,7.45 MSP430FR4133.13 | 46.28,10.2 40.6,10.2 39.2,8.8 36.9,8.8 36.3,8.2 36.3,4.5 35.95,4.15 U1.12 32.35,4.15 31.9,4.6 R9.2 | 52.1,25.5 51.9,25.7 | 52.3,25.7 52.1,25.5 | 52.1,25.5 52.1,25.7 | 50.5,20.2 50.9,20.2 52.1,21.4 52.1,25.5 | IC1.1 56.65,41.25 56.5,41.1 51.8,41.1 | 51.8,41.1 51.6,41.1 | 51.6,41.1 49.1,41.1 48.8,41.4 48.8,42.33 U$5.6 | 51.6,41.1 51.7,41.2 | 51.8,41.1 51.7,41.2 | 51.7,41.2 v51.7,41.3 | v51.7,40 43.3,40 42.6,39.3 42.6,30.3 43.5,29.4 47.17,29.4 U4.6
  Top 0.305: IC2.3 56.14,29.14 55.9,28.9 55.9,26 55.5,25.7 | v55.7,25.9 55.5,25.7 | 55.5,25.7 52.3,25.7 52.1,25.7 51.9,25.7 49.6,25.7 49.3,26 49.3,27.27 U4.6 | MSP430FR4133.13 46.28,10.2 46.28,17.08 46.8,17.6 48.3,17.6 50.5,19.8 50.6,20 50.4,20 SDA.T 50.5,20.2
  Bottom 0.178: v54.5,27 v55.7,25.9
  Bottom 0.254: v51.7,41.3 v51.7,40
VCORE
  Top 0.178: U1.13 34.64,4.8 C8.1
XIN
  Top 0.254: X1.1 44.6,2.89 44.6,2.9 44.4,3.1 44.4,3.3 | MSP430FR4133.7 43.28,4.16 X1.1 | X1.1 43.7,2.1 43.7,1.63 C2.1
XOUT
  Top 0.254: 41.7,3.3 41.6,3.14 X1.2 | MSP430FR4133.6 42.78,4.22 X1.2 | X1.2 41.58,2.92 42.4,2.1 42.4,1.63 C1.1

### Text on the board
tPlace: +
bPlace: Temperature & Humidity Sensor node with LCD / design by Will Whang / 2016/07/01 | _